# Altium schematic sheet master-ESP32-GPS.SchDoc
size A4
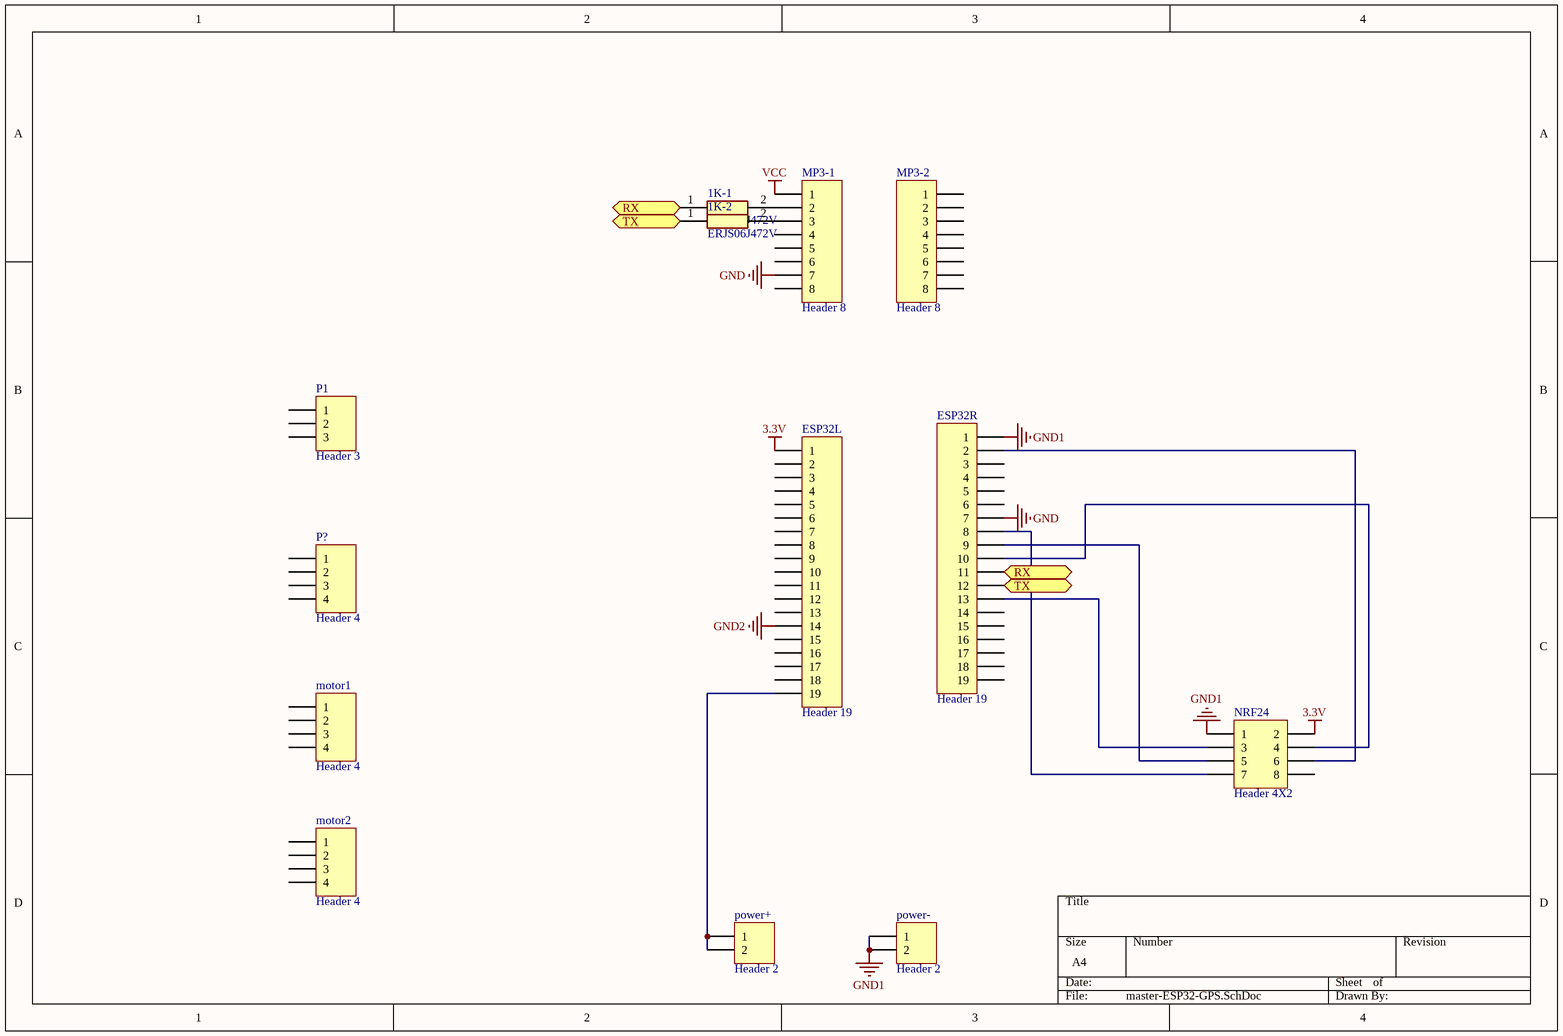
[diagram p0: master-ESP32-GPS.SchDoc]

## Parts
1K-1  ERJS06J472V  [RESC2012X70N]
1K-2  ERJS06J472V  [RESC2012X70N]
ESP32L  Header 19  [HDR1X19]
ESP32R  Header 19  [HDR1X19]
motor1  Header 4  [HDR1X4]
motor2  Header 4  [HDR1X4]
MP3-1  Header 8  [HDR1X8]
MP3-2  Header 8  [HDR1X8]
NRF24  Header 4X2  [HDR2X4]
P1  Header 3  [HDR1X3]
P?  Header 4  [HDR1X4]
power+  Header 2  [HDR1X2]
power-  Header 2  [HDR1X2]

## Ports
RX, TX

## Nets
3.3V: ESP32L.1 NRF24.2
GND: ESP32R.7 MP3-1.7
GND1: ESP32R.1 NRF24.1 power-.1 power-.2
GND2: ESP32L.14
VCC: MP3-1.1
RX: 1K-1.1 ESP32R.11 ; port RX
TX: 1K-2.1 ESP32R.12 ; port TX
Net1K-1_2: 1K-1.2 MP3-1.2
Net1K-2_2: 1K-2.2 MP3-1.3
NetESP32L_19: ESP32L.19 power+.1 power+.2
NetESP32R_2: ESP32R.2 NRF24.6
NetESP32R_8: ESP32R.8 NRF24.7
NetESP32R_9: ESP32R.9 NRF24.5
NetESP32R_10: ESP32R.10 NRF24.4
NetESP32R_13: ESP32R.13 NRF24.3

Not connected (* = marked no-connect by the designer): ESP32L 2 3 4 5 6 7 8 9 10 11 12 13 15 16 17 18; ESP32R 3 4 5 6 14 15 16 17 18 19; motor1 1 2 3 4; motor2 1 2 3 4; MP3-1 4 5 6 8; MP3-2 1 2 3 4 5 6 7 8; NRF24 8; P1 1 2 3; P? 1 2 3 4

## Library data of the parts
1K-1 1K-2 = ERJS06J472V: Resistor; Manufacturer_Name: Panasonic; Datasheet Link: https://industrial.panasonic.com/cdbs/www-data/pdf/RDP0000/AOA0000C334.pdf; Height: 0.7mm; Manufacturer_Part_Number: ERJS06J472V; Arrow Part Number: ERJS06J472V
ESP32L ESP32R = Header 19: Header, 19-Pin; LatestRevisionDate: 17-Jul-2002; LatestRevisionNote: Re-released for DXP Platform.; Publisher: Altium Limited
motor1 motor2 P? = Header 4: Header, 4-Pin; LatestRevisionDate: 17-Jul-2002; LatestRevisionNote: Re-released for DXP Platform.; Publisher: Altium Limited
MP3-1 MP3-2 = Header 8: Header, 8-Pin; LatestRevisionDate: 17-Jul-2002; LatestRevisionNote: Re-released for DXP Platform.; Publisher: Altium Limited
NRF24 = Header 4X2: Header, 4-Pin, Dual row; LatestRevisionDate: 17-Jul-2002; LatestRevisionNote: Re-released for DXP Platform.; Publisher: Altium Limited
P1 = Header 3: Header, 3-Pin; LatestRevisionDate: 17-Jul-2002; LatestRevisionNote: Re-released for DXP Platform.; Publisher: Altium Limited
power+ power- = Header 2: Header, 2-Pin; LatestRevisionDate: 17-Jul-2002; LatestRevisionNote: Re-released for DXP Platform.; Publisher: Altium Limited